# Altium schematic sheet Usb.SchDoc
size A4; SheetNumber: 8; SheetTotal: 8
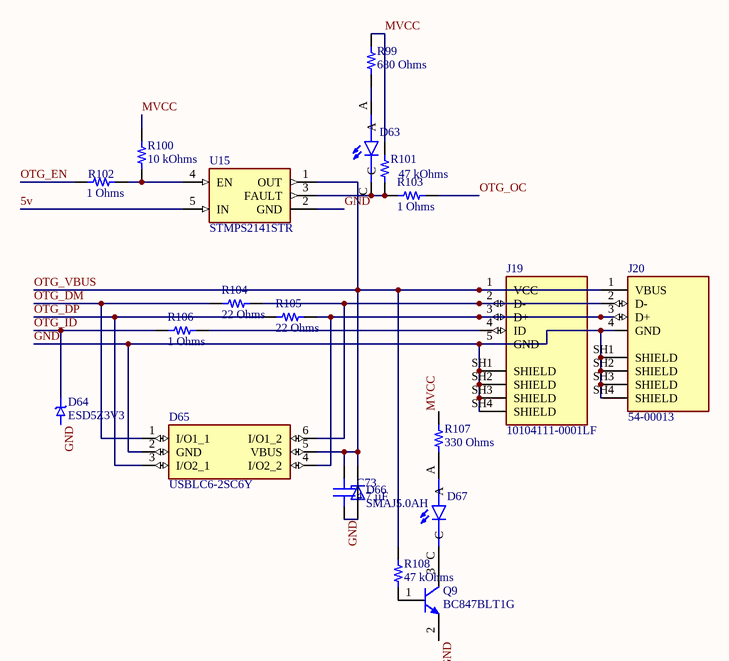
[diagram p0: Usb.SchDoc]

## Parts
C73  4.7 µF  [CAP 0805_2012]
D63  597-3305-607F  [LEDC2012X70N]  (value not drawn)
D64  ESD5Z3V3  [SOD-523_DIOTEC-SEMICONDUCTOR]
D65  USBLC6-2SC6Y  [SOT95P280X145-6N]
D66  SMAJ5.0AH  [DIOM4325X250N]
D67  597-3305-607F  [LEDC2012X70N]  (value not drawn)
J19  10104111-0001LF  [AMPHENOL_10104111-0001LF]
J20  54-00013  [TENSILITY_54-00013]
Q9  BC847BLT1G  [ON SEMI SOT-23-3]
R99  680 Ohms  [RES 0805_2012]
R100  10 kOhms  [YAGEO RES 0805_2012]
R101  47 kOhms  [YAGEO RES 0805_2012]
R102  1 Ohms  [RES 0805_2012]
R103  1 Ohms  [RES 0805_2012]
R104  22 Ohms  [RES 0805_2012]
R105  22 Ohms  [RES 0805_2012]
R106  1 Ohms  [RES 0805_2012]
R107  330 Ohms  [RES 0805_2012]
R108  47 kOhms  [YAGEO RES 0805_2012]
U15  STMPS2141STR  [SOT95P280X145-5N]

## Nets
5v: U15.5(IN)
GND: C73.1 D64.2(A) D65.2(GND) D66.A J19.5(GND) J19.SH1(SHIELD) J19.SH2(SHIELD) J19.SH3(SHIELD) J19.SH4(SHIELD) J20.4(GND) J20.SH1(SHIELD) J20.SH2(SHIELD) J20.SH3(SHIELD) J20.SH4(SHIELD) Q9.2(E) U15.2(GND)
MVCC: R99.2 R100.2 R101.2 R107.2
OTG_DM: D65.1(I/O1_1) R104.1
OTG_DP: D65.3(I/O2_1) R105.1
OTG_EN: R102.1
OTG_ID: D64.1(C) R106.1
OTG_OC: R103.2
OTG_VBUS: C73.2 D65.5(VBUS) D66.C J19.1(VCC) J20.1(VBUS) R108.2 U15.1(OUT)
NetD63_A: D63.A R99.1
NetD63_C: D63.C R101.1 R103.1 U15.3(FAULT)
NetD65_4: D65.4(I/O2_2) J19.3(D+) J20.3(D+) R105.2
NetD65_6: D65.6(I/O1_2) J19.2(D-) J20.2(D-) R104.2
NetD67_A: D67.A R107.1
NetD67_C: D67.C Q9.3(C)
NetJ19_4: J19.4(ID) R106.2
NetQ9_1: Q9.1(B) R108.1
NetR100_1: R100.1 R102.2 U15.4(EN)

## Library data of the parts
C73 = C0805X475M3RAC7800: 4.70UF 25.0V; manufacturer: KEMET; Temperature Coefficient: X7R; Tolerance: ±20%; Voltage - Rated: 25V; Part Number: C0805X475M3RAC7800; Capacitance: 4.7 µF; Applications: Boardflex Sensitive; componentlink1description: Datasheet; componentlink1url: https://connect.kemet.com:7667/gateway/IntelliData-ComponentDocumentation/1.0/download/datasheet/C0805X475M3RAC7800; componentlink2description: DigiKey Link; componentlink2url: https://www.digikey.com/en/products/detail/kemet/C0805X475M3RAC7800/12082671; Device Package: 0805 (2012 Metric); Features: Soft Termination; lastupdated: 29-03-2026 7.18.51 PM; Lifecycle Status: Active; Minimum Order: 1; Mounting Type: Surface Mount, MLCC; Operating Temperature: -55°C ~ 125°C; Package / Case: 0805 (2012 Metric); packaging: TapeAndReel; partid: 46494; Part Status: Active; price: 0.15; series: SMD Comm X7R Flex; Size / Dimension: 0.079" L x 0.049" W (2.00mm x 1.25mm); Supplier 1: DigiKey; Supplier Part Number 1: 399-C0805X475M3RAC7800CT-ND; Thickness (Max): 0.057" (1.45mm); value: 4.7 µF
D63 D67 = 597-3305-607F: LED Uni-Color Green 4-Pin Chip 0805 T/R; Availability: Unavailable; Value: *; Price: None; MP: 597-3305-607F; Package: None
D64 = ESD5Z3V3: ESD, SOD-523, 0.05ÂµA, 3.3V, Unidir; MF: Diotec Semiconductor; SnapEDA_Link: https://www.snapeda.com/parts/ESD5Z3V3/Diotec/view-part/?ref=snap; Package: SOD-523 Diotec; Value: *; MP: ESD5Z3V3; Check_prices: https://www.snapeda.com/parts/ESD5Z3V3/Diotec/view-part/?ref=eda
D65 = USBLC6-2SC6Y: 17V Clamp 5A (8/20µs) Ipp Tvs Diode Surface Mount SOT-23-6; MF: STMicroelectronics; SnapEDA_Link: https://www.snapeda.com/parts/USBLC6-2SC6Y/STMicroelectronics/view-part/?ref=snap; Package: SOT-23-6 STMicroelectronics; Value: *; MP: USBLC6-2SC6Y; Check_prices: https://www.snapeda.com/parts/USBLC6-2SC6Y/STMicroelectronics/view-part/?ref=eda
J19 = 10104111-0001LF: Conn Data USB TypeAB Socket 5Cnts RightAngle Micro SMT | Amphenol FCI (Amphenol CS) 10104111-0001LF; SnapEDA_Link: https://www.snapeda.com/parts/10104111-0001LF/Amphenol/view-part/?ref=snap; Package: None; Value: *; MF: Amphenol; MP: 10104111-0001LF; Check_prices: https://www.snapeda.com/parts/10104111-0001LF/Amphenol/view-part/?ref=eda
J20 = 54-00013: Connector, USB A Jack, PCB side-mount, 90 degrees, nickel shell, board lock, black insulator, tray; MF: Tensility International Corporation; SnapEDA_Link: https://www.snapeda.com/parts/54-00013/Tensility/view-part/?ref=snap; Package: None; Value: *; MP: 54-00013; Check_prices: https://www.snapeda.com/parts/54-00013/Tensility/view-part/?ref=eda
Q9 = BC847BLT1G: TRANS NPN 45V 0.1A SOT23; Manufacturer: ON Semiconductor; Current - Collector Cutoff (Max): 15nA (ICBO); Current - Collector (Ic) (Max): 100mA; DC Current Gain (hFE) (Min) @ Ic, Vce: 200 @ 2mA, 5V; Frequency - Transition: 100MHz; Power - Max: 300mW; Vce Saturation (Max) @ Ib, Ic: 600mV @ 5mA, 100mA; Part Number: BC847BLT1G; ComponentLink1Description: Datasheet; ComponentLink1URL: http://www.onsemi.com/pub/Collateral/BC846ALT1-D.PDF; ComponentLink2Description: DigiKey Link; ComponentLink2URL: http://digikey.com/product-detail/en/on-semiconductor/BC847BLT1G/BC847BLT1GOSCT-ND/917834; LastUpdated: 29-03-2026 8.43.49 PM; Lifecycle Status: Active; Minimum Order: 1; Mounting Type: Surface Mount; Operating Temperature: -55°C ~ 150°C (TJ); Package / Case: TO-236-3, SC-59, SOT-23-3; Packaging: TapeAndReel; PartId: 246; Part Status: Active; Price: 0.02; Series: -; Supplier 1: DigiKey; Supplier Part Number 1: BC847BLT1GOSCT-ND; Supplier Device Package: SOT-23-3 (TO-236); Transistor Type: NPN; Voltage - Collector Emitter Breakdown (Max): 45V
R99 = RNCF0805DTE680R: RES SMD 680 OHM 0.5% 1/4W 0805; Manufacturer: Stackpole Electronics Inc; Power (Watts): 0.25W, 1/4W; Temperature Coefficient: ±25ppm/°C; Part Number: RNCF0805DTE680R; Value: 680 Ohms; ComponentLink1Description: Datasheet; ComponentLink1URL: https://www.seielect.com/catalog/sei-rncf.pdf; ComponentLink2Description: DigiKey Link; ComponentLink2URL: https://www.digikey.com/en/products/detail/stackpole-electronics-inc/RNCF0805DTE680R/6241785; Composition: Thin Film; Device Package: 0805 (2012 Metric); Features: Automotive AEC-Q200; Height - Seated (Max): 0.026" (0.65mm); LastUpdated: 30-03-2026 8.13.21 PM; Lifecycle Status: Active; Minimum Order: 1; Number of Terminations: 2; Operating Temperature: -55°C ~ 155°C; Package / Case: 0805 (2012 Metric); Packaging: TapeAndReel; PartId: 28010; Part Status: Active; Price: 0.01; Ratings: AEC-Q200; Resistance: 680 Ohms; Series: RNCF; Size / Dimension: 0.079" L x 0.049" W (2.00mm x 1.25mm); Supplier 1: DigiKey; Supplier Part Number 1: 738-RNCF0805DTE680RCT-ND; Supplier Device Package: 0805; Tolerance: ±0.5%
R100 = RT0805DRD0710KL: RES SMD 10K OHM 0.5% 1/8W 0805; Manufacturer: Yageo; Power (Watts): 0.125W, 1/8W; Temperature Coefficient: ±25ppm/°C; Part Number: RT0805DRD0710KL; Value: 10 kOhms; ComponentLink1Description: Datasheet; ComponentLink1URL: https://www.yageo.com/upload/media/product/productsearch/datasheet/rchip/PYu-RT_1-to-0.01_RoHS_L_11.pdf; ComponentLink2Description: DigiKey Link; ComponentLink2URL: https://www.digikey.com/en/products/detail/yageo/RT0805DRD0710KL/1077814; Composition: Thin Film; Device Package: 0805 (2012 Metric); Height - Seated (Max): 0.024" (0.60mm); LastUpdated: 30-03-2026 9.20.29 PM; Lifecycle Status: Active; Minimum Order: 1; Number of Terminations: 2; Operating Temperature: -55°C ~ 155°C; Package / Case: 0805 (2012 Metric); Packaging: TapeAndReel; PartId: 27797; Part Status: Active; Price: 0.02; Resistance: 10 kOhms; Series: RT; Size / Dimension: 0.079" L x 0.049" W (2.00mm x 1.25mm); Supplier 1: DigiKey; Supplier Part Number 1: 311-2699-1-ND; Supplier Device Package: 0805; Tolerance: ±0.5%
R101 R108 = RT0805DRD0747KL: RES SMD 47K OHM 0.5% 1/8W 0805; Manufacturer: Yageo; Power (Watts): 0.125W, 1/8W; Temperature Coefficient: ±25ppm/°C; Part Number: RT0805DRD0747KL; Value: 47 kOhms; ComponentLink1Description: Datasheet; ComponentLink1URL: https://www.yageo.com/upload/media/product/productsearch/datasheet/rchip/PYu-RT_1-to-0.01_RoHS_L_11.pdf; ComponentLink2Description: DigiKey Link; ComponentLink2URL: https://www.digikey.com/en/products/detail/yageo/RT0805DRD0747KL/1078180; Composition: Thin Film; Device Package: 0805 (2012 Metric); Height - Seated (Max): 0.024" (0.60mm); LastUpdated: 30-03-2026 9.20.29 PM; Lifecycle Status: Active; Minimum Order: 1; Number of Terminations: 2; Operating Temperature: -55°C ~ 155°C; Package / Case: 0805 (2012 Metric); Packaging: TapeAndReel; PartId: 27804; Part Status: Active; Price: 0.02; Resistance: 47 kOhms; Series: RT; Size / Dimension: 0.079" L x 0.049" W (2.00mm x 1.25mm); Supplier 1: DigiKey; Supplier Part Number 1: 311-2747-1-ND; Supplier Device Package: 0805; Tolerance: ±0.5%
R102 R103 R106 = CSR0805FK1R00: RES 1 OHM 1% 1/4W 0805; Manufacturer: Stackpole Electronics Inc; Power (Watts): 0.25W, 1/4W; Temperature Coefficient: ±200ppm/°C; Part Number: CSR0805FK1R00; Value: 1 Ohms; ComponentLink1Description: Datasheet; ComponentLink1URL: https://www.seielect.com/catalog/sei-csr_csrn.pdf; ComponentLink2Description: DigiKey Link; ComponentLink2URL: https://www.digikey.com/en/products/detail/stackpole-electronics-inc/CSR0805FK1R00/2217466; Composition: Thick Film; Device Package: 0805 (2012 Metric); Features: Current Sense; Height - Seated (Max): 0.026" (0.65mm); LastUpdated: 30-03-2026 8.13.19 PM; Lifecycle Status: Active; Minimum Order: 1; Number of Terminations: 2; Operating Temperature: -55°C ~ 155°C; Package / Case: 0805 (2012 Metric); Packaging: TapeAndReel; PartId: 28379; Part Status: Active; Price: 0.03; Resistance: 1 Ohms; Series: CSR; Size / Dimension: 0.079" L x 0.049" W (2.00mm x 1.25mm); Supplier 1: DigiKey; Supplier Part Number 1: CSR0805FK1R00CT-ND; Supplier Device Package: 0805; Tolerance: ±1%
R104 R105 = CRGH0805J22R: RES 22 OHM 5% 1/3W 0805; Manufacturer: TE Connectivity Passive Product; Power (Watts): 0.333W, 1/3W; Temperature Coefficient: ±100ppm/°C; Part Number: CRGH0805J22R; Value: 22 Ohms; ComponentLink1Description: Datasheet; ComponentLink1URL: https://www.te.com/commerce/DocumentDelivery/DDEController?Action=srchrtrv&DocNm=1773204-1&DocType=DS&DocLang=English; ComponentLink2Description: DigiKey Link; ComponentLink2URL: https://www.digikey.com/en/products/detail/te-connectivity-passive-product/CRGH0805J22R/2385484; Composition: Thick Film; Device Package: 0805 (2012 Metric); Features: Automotive AEC-Q200; LastUpdated: 30-03-2026 8.13.21 PM; Lifecycle Status: Active; Minimum Order: 1; Number of Terminations: 2; Operating Temperature: -55°C ~ 155°C; Package / Case: 0805 (2012 Metric); Packaging: TapeAndReel; PartId: 28124; Part Status: Active; Price: 0.01; Ratings: AEC-Q200; Resistance: 22 Ohms; Series: CRGH, Neohm; Size / Dimension: 0.079" L x 0.049" W (2.00mm x 1.25mm); Supplier 1: DigiKey; Supplier Part Number 1: A126437CT-ND; Supplier Device Package: 0805; Tolerance: ±5%
R107 = CRCW0805330RFKEAHP: RES SMD 330 OHM 1% 1/2W 0805; Manufacturer: Vishay Dale; Power (Watts): 0.5W, 1/2W; Temperature Coefficient: ±100ppm/°C; Part Number: CRCW0805330RFKEAHP; Value: 330 Ohms; ComponentLink1Description: Datasheet; ComponentLink1URL: http://www.vishay.com/docs/20043/crcwhpe3.pdf; ComponentLink2Description: DigiKey Link; ComponentLink2URL: https://www.digikey.com/en/products/detail/vishay-dale/CRCW0805330RFKEAHP/2226912; Composition: Thick Film; Device Package: 0805 (2012 Metric); Features: Automotive AEC-Q200, Pulse Withstanding; Height - Seated (Max): 0.024" (0.60mm); LastUpdated: 30-03-2026 8.13.11 PM; Lifecycle Status: Active; Minimum Order: 1; Number of Terminations: 2; Operating Temperature: -55°C ~ 155°C; Package / Case: 0805 (2012 Metric); Packaging: TapeAndReel; PartId: 30364; Part Status: Active; Price: 0.02; Ratings: AEC-Q200; Resistance: 330 Ohms; Series: CRCW-HP e3; Size / Dimension: 0.079" L x 0.049" W (2.00mm x 1.25mm); Supplier 1: DigiKey; Supplier Part Number 1: 541-330TCT-ND; Supplier Device Package: 0805; Tolerance: ±1%
U15 = STMPS2141STR: Power Switch/Driver 1:1 N-Channel 500mA SOT-23-5; MF: STMicroelectronics; MP: STMPS2141STR; Package: SOT-23 STMicroelectronics; Purchase-URL: https://pricing.snapeda.com/search/part/STMPS2141STR/?ref=eda; Check_prices: https://www.snapeda.com/parts/STMPS2141STR/STMicroelectronics/view-part/?ref=eda; Value: *; Digi-Key_Part_Number: 497-6933-2-ND; SnapEDA_Link: https://www.snapeda.com/parts/STMPS2141STR/STMicroelectronics/view-part/?ref=snap
D66 = SMAJ5.0AH: Package: None; Price: None; Value: *; MP: SMAJ5.0AH; Availability: Unavailable